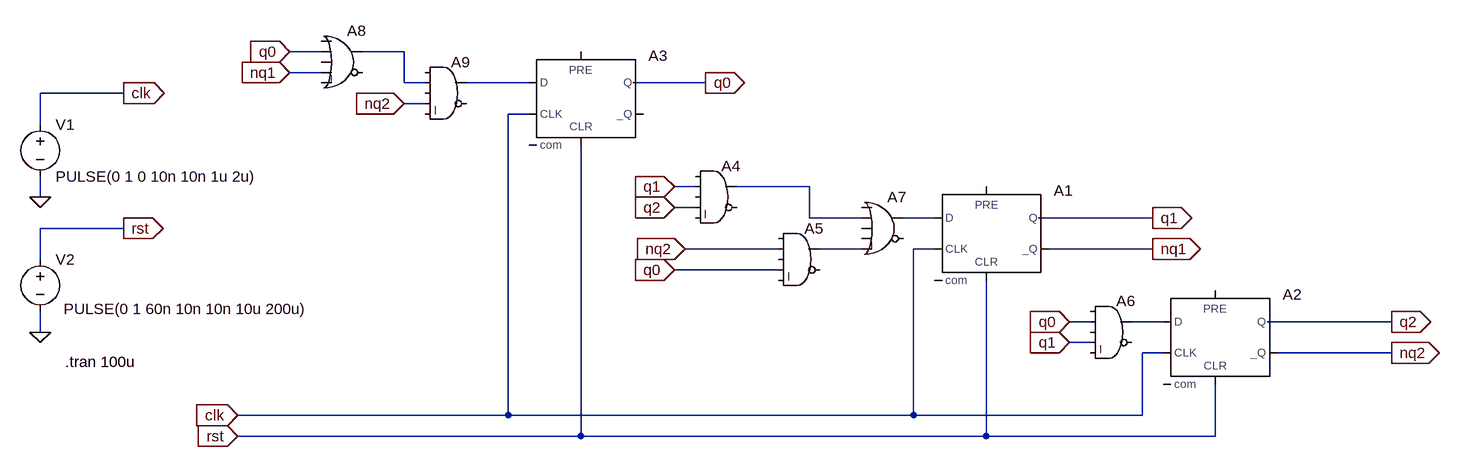
[diagram p0: schematic logic_divide-by-three.asc]
logic_divide-by-three.asc, the LTspice schematic file:
Version 4
SHEET 1 1432 1048
WIRE -320 96 -368 96
WIRE -192 96 -256 96
WIRE -320 128 -368 128
WIRE -192 144 -192 96
WIRE -160 144 -192 144
WIRE 0 144 -96 144
WIRE 272 144 160 144
WIRE -624 160 -752 160
WIRE -160 176 -192 176
WIRE 0 192 -32 192
WIRE -752 208 -752 160
WIRE 256 304 224 304
WIRE 432 304 320 304
WIRE -752 320 -752 288
WIRE 256 336 224 336
WIRE 432 352 432 304
WIRE 512 352 432 352
WIRE 624 352 576 352
WIRE 960 352 784 352
WIRE -624 368 -752 368
WIRE 384 400 240 400
WIRE 512 400 448 400
WIRE 624 400 592 400
WIRE 960 400 800 400
WIRE -752 416 -752 368
WIRE 384 432 224 432
WIRE 864 512 832 512
WIRE 976 512 928 512
WIRE 1328 512 1136 512
WIRE -752 528 -752 496
WIRE 864 544 832 544
WIRE 976 560 944 560
WIRE 1328 560 1152 560
WIRE -32 656 -32 192
WIRE -32 656 -448 656
WIRE 592 656 592 400
WIRE 592 656 -32 656
WIRE 944 656 944 560
WIRE 944 656 592 656
WIRE 80 688 80 240
WIRE 80 688 -448 688
WIRE 704 688 704 448
WIRE 704 688 80 688
WIRE 1056 688 1056 608
WIRE 1056 688 704 688
FLAG -752 320 0
FLAG -624 160 clk
IOPIN -624 160 Out
FLAG -752 528 0
FLAG -624 368 rst
IOPIN -624 368 Out
FLAG -448 688 rst
IOPIN -448 688 In
FLAG 960 352 q1
IOPIN 960 352 Out
FLAG 1328 512 q2
IOPIN 1328 512 Out
FLAG 272 144 q0
IOPIN 272 144 Out
FLAG 224 304 q1
IOPIN 224 304 In
FLAG 224 336 q2
IOPIN 224 336 In
FLAG 224 432 q0
IOPIN 224 432 In
FLAG 832 512 q0
IOPIN 832 512 In
FLAG 832 544 q1
IOPIN 832 544 In
FLAG 960 400 nq1
IOPIN 960 400 Out
FLAG -368 128 nq1
IOPIN -368 128 In
FLAG -368 96 q0
IOPIN -368 96 In
FLAG -192 176 nq2
IOPIN -192 176 In
FLAG 1328 560 nq2
IOPIN 1328 560 Out
FLAG 240 400 nq2
IOPIN 240 400 In
FLAG -448 656 clk
IOPIN -448 656 In
SYMBOL voltage -752 192 R0
WINDOW 123 0 0 Left 0
WINDOW 39 0 0 Left 0
SYMATTR InstName V1
SYMATTR Value PULSE(0 1 0 10n 10n 1u 2u)
SYMBOL Digital\\dflop 704 304 R0
WINDOW 3 8 168 Invisible 0
SYMATTR InstName A1
SYMATTR Value trise=10n td=10n
SYMBOL Digital\\dflop 1056 464 R0
WINDOW 3 8 12 Invisible 0
SYMATTR InstName A2
SYMATTR Value trise=10n td=10n
SYMBOL Digital\\dflop 80 96 R0
WINDOW 3 8 168 Invisible 0
SYMATTR InstName A3
SYMATTR Value trise=10n td=10n
SYMBOL Digital\\and 288 256 R0
SYMATTR InstName A4
SYMBOL Digital\\and 416 352 R0
SYMATTR InstName A5
SYMBOL voltage -752 400 R0
WINDOW 3 36 92 Left 0
WINDOW 123 0 0 Left 0
WINDOW 39 0 0 Left 0
SYMATTR InstName V2
SYMATTR Value PULSE(0 1 60n 10n 10n 10u 200u)
SYMBOL Digital\\and 896 464 R0
SYMATTR InstName A6
SYMBOL Digital\\and -128 96 R0
SYMATTR InstName A9
SYMBOL Digital\\or 544 304 R0
SYMATTR InstName A7
SYMBOL Digital\\or -288 48 R0
SYMATTR InstName A8
TEXT -714 574 Left 0 !.tran 100u

The netlist it stands for:
* logic_divide-by-three.asc
V1 clk 0 PULSE(0 1 0 10n 10n 1u 2u)
A1 N004 0 clk 0 rst nq1 q1 0 DFLOP trise=10n td=10n
A2 N006 0 clk 0 rst nq2 q2 0 DFLOP trise=10n td=10n
A3 N002 0 clk 0 rst 0 q0 0 DFLOP trise=10n td=10n
A4 0 q1 0 q2 0 0 N003 0 AND
A5 0 nq2 0 q0 0 0 N005 0 AND
V2 rst 0 PULSE(0 1 60n 10n 10n 10u 200u)
A6 0 q0 0 q1 0 0 N006 0 AND
A9 0 N001 0 nq2 0 0 N002 0 AND
A7 0 N003 0 0 N005 0 N004 0 OR
A8 0 q0 0 nq1 0 0 N001 0 OR
.tran 100u
.backanno
.end